# Altium project NAATOS_INLAY_MK8.PrjPcb
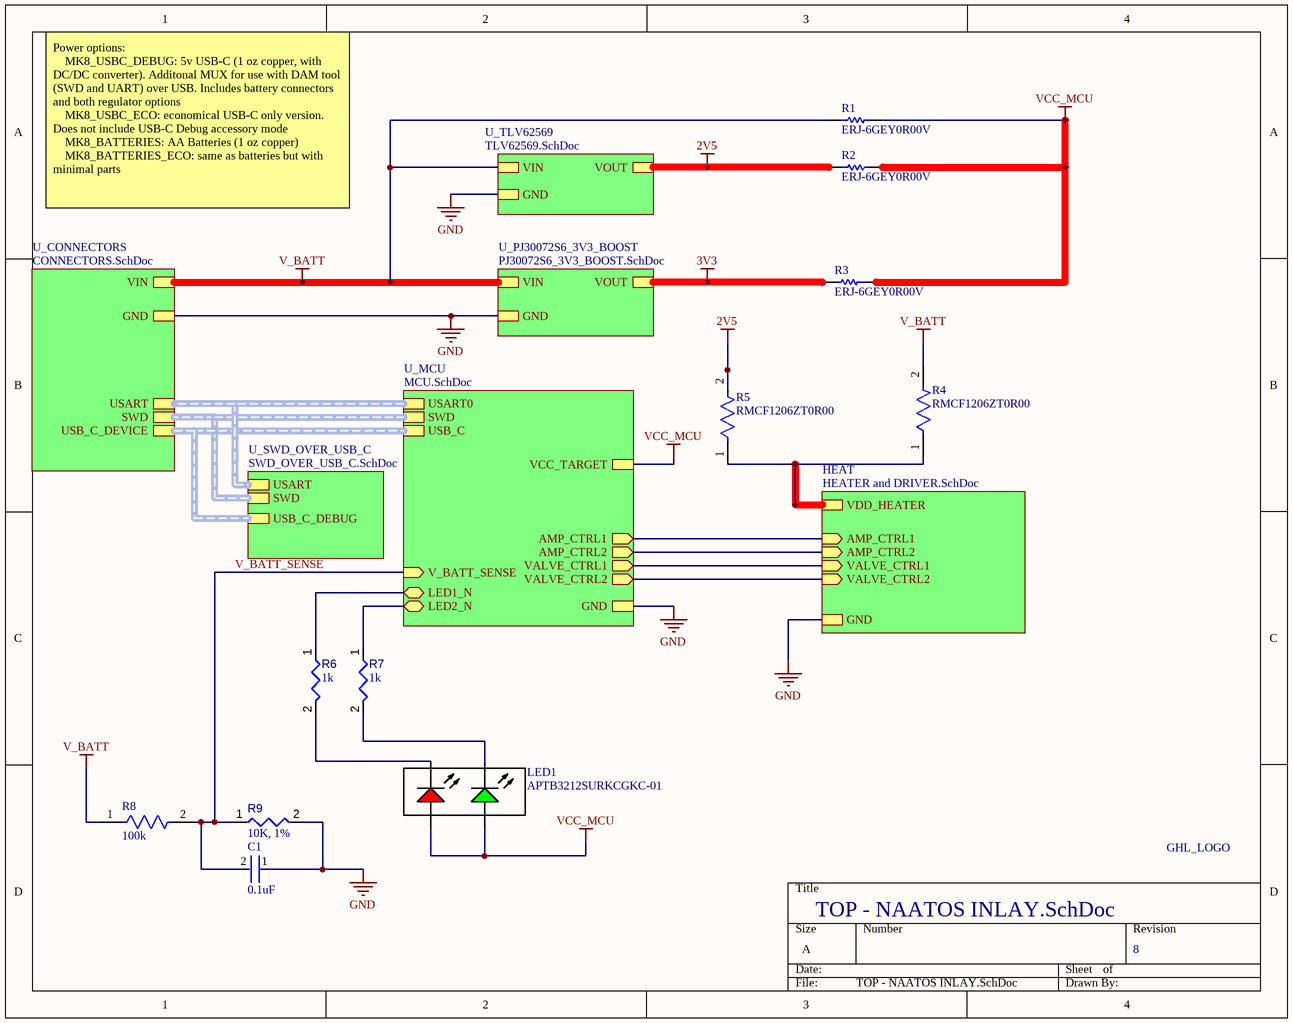
[diagram p0: TOP - NAATOS INLAY.SchDoc]
7 sheets, 78 parts. Net scope: strictly hierarchical (ports join the sheet entries above them; power ports are local).
Board file: INLAY PCB.PcbDoc
Sheets:
  TOP - NAATOS INLAY.SchDoc
    HEAT = HEATER and DRIVER.SchDoc
    U_CONNECTORS = CONNECTORS.SchDoc
    U_MCU = MCU.SchDoc
    U_TLV62569 = TLV62569.SchDoc
    U_PJ30072S6_3V3_BOOST = PJ30072S6_3V3_BOOST.SchDoc
    U_SWD_OVER_USB_C = SWD_OVER_USB_C.SchDoc

## Sheet TOP - NAATOS INLAY.SchDoc
size A; Revision: 8; SheetNumber: 1; SheetTotal: 7

### Parts
C1  0.1uF  [FP-CL17-IPC_C]
LED1  APTB3212SURKCGKC-01  [APTB3212SURKCGKC-01]
LOGO1  GHL_LOGO  [GHLABS_LOGO]
R1  ERJ-6GEY0R00V  [RESC2013X70X40NL20T20]
R2  ERJ-6GEY0R00V  [RESC2013X70X40NL20T20]
R3  ERJ-6GEY0R00V  [RESC2013X70X40NL20T20]
R4  RMCF1206ZT0R00  [FP-RMCF1206-MFG]
R5  RMCF1206ZT0R00  [FP-RMCF1206-MFG]
R6  value 1k  [RESC1608X55X25ML10T15]  (hidden comment: Resistor 1k +/-1% 0603 100 mW)
R7  value 1k  [RESC1608X55X25ML10T15]  (hidden comment: Resistor 1k +/-1% 0603 100 mW)
R8  Resistance: 100k  [FP-CRCW0402-e3-IPC_C]  (hidden comment: CRCW0402100KFKED)
R9  value 10K, 1%  [RESC0402(1005)_L]  (hidden comment: Resistor 10K  +/-1 % 0402 63 mW)

### Sub-sheets
HEAT = HEATER and DRIVER.SchDoc: GND, VDD_HEATER, AMP_CTRL1 (in), VALVE_CTRL1 (in), AMP_CTRL2 (in), VALVE_CTRL2 (in)
U_CONNECTORS = CONNECTORS.SchDoc: GND, USART (harness USART), VIN, USB_C_DEVICE (harness USB_C), SWD (harness SWD)
U_MCU = MCU.SchDoc: USART0 (harness USART), VCC_TARGET, GND, AMP_CTRL1 (out), AMP_CTRL2 (out), VALVE_CTRL1 (out), VALVE_CTRL2 (out), V_BATT_SENSE (in), LED1_N (bidir), LED2_N (bidir), SWD (harness SWD), USB_C (harness USB_C)
U_PJ30072S6_3V3_BOOST = PJ30072S6_3V3_BOOST.SchDoc: VIN, GND, VOUT
U_SWD_OVER_USB_C = SWD_OVER_USB_C.SchDoc: USB_C_DEBUG (harness USB_C), SWD (harness SWD), USART (harness USART)
U_TLV62569 = TLV62569.SchDoc: VOUT, VIN, GND

### Nets
2V5: R2.1 R5.2 ; sheet U_TLV62569/VOUT
3V3: R3.1 ; sheet U_PJ30072S6_3V3_BOOST/VOUT
GND: C1.1 R9.2 ; sheet HEAT/GND, sheet U_CONNECTORS/GND, sheet U_MCU/GND, sheet U_TLV62569/GND, sheet U_PJ30072S6_3V3_BOOST/GND
V_BATT: R1.1 R4.2 R8.1 ; sheet U_CONNECTORS/VIN, sheet U_TLV62569/VIN, sheet U_PJ30072S6_3V3_BOOST/VIN
VCC_MCU: LED1.2(A) LED1.3(A) R1.2 R2.2 R3.2 ; sheet U_MCU/VCC_TARGET
AMP_CTRL1: sheet HEAT/AMP_CTRL1, sheet U_MCU/AMP_CTRL1
AMP_CTRL2: sheet HEAT/AMP_CTRL2, sheet U_MCU/AMP_CTRL2
HEATER+: R4.1 R5.1 ; sheet HEAT/VDD_HEATER
LED1_N: R6.1 ; sheet U_MCU/LED1_N
LED2_N: R7.1 ; sheet U_MCU/LED2_N
V_BATT_SENSE: C1.2 R8.2 R9.1 ; sheet U_MCU/V_BATT_SENSE
VALVE_CTRL1: sheet HEAT/VALVE_CTRL1, sheet U_MCU/VALVE_CTRL1
VALVE_CTRL2: sheet HEAT/VALVE_CTRL2, sheet U_MCU/VALVE_CTRL2
NetLED1_1: LED1.1(K) R6.2
NetLED1_4: LED1.4(K) R7.2

### Buses and harness runs
harness sheet U_CONNECTORS/SWD = sheet U_MCU/SWD = sheet U_SWD_OVER_USB_C/SWD
harness sheet U_CONNECTORS/USART = sheet U_MCU/USART0 = sheet U_SWD_OVER_USB_C/USART
harness sheet U_CONNECTORS/USB_C_DEVICE = sheet U_MCU/USB_C = sheet U_SWD_OVER_USB_C/USB_C_DEBUG

### Notes on the sheet
- Power options:
  MK8_USBC_DEBUG: 5v USB-C (1 oz copper, with DC/DC converter). Additonal MUX for use with DAM tool (SWD and UART) over USB. Includes battery connectors and both regulator options
  MK8_USBC_ECO: economical USB-C only version. Does not include USB-C Debug accessory mode
  MK8_BATTERIES: AA Batteries (1 oz copper)
  MK8_BATTERIES_ECO: same as batteries but with minimal parts

### Library data of the parts
C1 = CMP-13271-001069-1: Cap Ceramic 100nF 10V X7R ±10% SMD 0402 +125°C Paper T/R; Height: 0.5mm; Case/Package: 0402; Contact Plating: Tin; Case Code (Imperial): 0402; Capacitance: 100nF; Thickness: 0.022inch; Min Operating Temperature: -55°C; Package Quantity: 1; Length: 1mm; Max Operating Temperature: 125°C; Depth: 0.5mm; Voltage Rating: 10V; Packaging: Tape and Reel; Mount: Surface Mount; Tolerance: 10%; Width: 0.02inch; Radiation Hardening: No; Case Code (Metric): 1005; Dielectric: X7R
LED1 = APTB3212SURKCGKC-01: Dual Color LED; Manufacturer: Kingbright; Supplier: Mouser; Supplier Part Number: 604-APTB3212SURKCGKC; Manufacturer Part Number: APTB3212SURKCGKC-01; RoHS: Yes; Category: LEDs; Stock: 2181; Pricing: 1=0.59, 10=0.409, 50=0.409, 100=0.295, 500=0.243, 1000=0.226, 2000=0.222, 4000=0.195, 10000=0.18, 24000=0.173 (USD); RoHS Compliant: Yes; ComponentLink1URL: https://datasheet.ciiva.com:443/pdfs/VipMasterIC/IC/KBEC/KBEC-S-A0008946974/KBEC-S-A0008946997-1.pdf?src-supplier=IHS+Markit; ComponentLink1Description: https://datasheet.ciiva.com:443/pdfs/VipMasterIC/IC/KBEC/KBEC-S-A0008946974/KBEC-S-A0008946997-1.pdf?src-supplier=IHS+Markit; Supplier 1: Digikey; Supplier Part Number 1: 754-APTB3212SURKCGKC-01CT-ND
LOGO1 = CMP-439-000000-1: Design Item ID: GHL_LOGO; Source: GHLABS_LOGO.SchLib
R1-R3 = CMP-1665-00002-5: Chip Resistor, 0 Ohm, +/- 1%, 0.125 W, -55 to 155 degC, 0805 (2012 Metric), RoHS, Tape and Reel; Tolerance: 5%; Resistance: 0 Ohm; REACH SVHC: No SVHC; Min Operating Temperature: -55 degC; Case/Package: 0805; Packaging: Tape and Reel; Package Quantity: 5000; ComponentLink1Description: Manufacturer URL; PackageDescription: 2-Pin Surface Mount Device, Body 2 x 1.25 mm; Mounting Technology: Surface Mount; Max Operating Temperature: 155 degC; PartNumber: ERJ-6GEY0R00V; Width: 1.25 mm; RoHSCompliant: True; Height: 0.6 mm; ComponentLink1URL: http://www.panasonic.com/; ComponentLink2URL: http://industrial.panasonic.com/cdbs/www-data/pdf/RDA0000/AOA0000C84.pdf; Case Code (Imperial): 0805; DatasheetVersion: 03/2015; Length: 2 mm; Case Code (Metric): 2012; ComponentLink2Description: Datasheet; Radiation Hardening: No
R4 R5 = CMP-26527-005649-1: 0Ω ±0 0.25W 1206 Thick Film Chip Resistor AEC-Q200 compliant; Working Voltage: 200V; Power Rating: 250mW; Current Rating: 2A; Resistance: 0R; Construction: Rectangular; RoHS Compliant: Yes; Military Standard: Not; Radiation Hardening: No; Case/Package: 1206; Case Code (Imperial): 1206; Packaging: Tape and Reel; Resistor Type: Thick Film; Mount: Surface Mount; Lead Free: Lead Free; Case Code (Metric): 3216; Width: 0.063inch; Series: RMCF; Features: Automotive AEC-Q200; Number of Terminations: 2; Min Operating Temperature: -55°C; Max Power Dissipation: 250mW; Contact Plating: Tin; Length: 0.126inch; Height: 0.028inch; Technology: THICK FILM; Max Operating Temperature: 155°C; Depth: 1.6mm
R6 R7 = CMP-009-00014-4: Chip Resistor, 1 KOhm, +/-1%, 0.1 W, -55 to 155 degC, 0603 (1608 Metric); Power: 100mW; Tolerance: 1%; Voltage Rating: 50V; Max Operating Temperature: 155°C; Pins: 2; RoHS Compliant: True; Case/Package: 0603; Min Operating Temperature: -55°C; Mounting Technology: SM
R8 = CMP-2002-08123-3: RES Thick Film, 100kΩ, 1%, 0.063W, 100ppm/°C, 0402; Power Rating: 63mW; Voltage Rating (DC): 50V; Lead Free: Lead Free; Height: 0.35mm; Contact Plating: Tin; Min Operating Temperature: -55°C; Package Quantity: 10000; Case/Package: 0402; Temperature Coefficient: 100ppm/°C; Number of Terminations: 2; Packaging: Tape and Reel; Max Power Dissipation: 63mW; Case Code (Metric): 1005; Mount: Surface Mount; Width: 0.02inch; Termination: SMD/SMT; Length: 1mm; Number of Pins: 2; Weight: 2.3E-05oz; Radiation Hardening: No; Tolerance: 1%; Military Standard: Not; Features: Automotive AEC-Q200; Depth: 0.5mm; Composition: Thick Film; Max Operating Temperature: 155°C; Voltage Rating: 50V; Case Code (Imperial): 0402
R9 = CMP-009-00149-2: Chip Resistor, 10 kOhms, +/-1 %, 63 mW, -55 to 125 degC, 0402; Power: 63mW; Tolerance: 1%; Pins: 2; Max Operating Temperature: 155°C; Min Operating Temperature: -55°C; Case/Package: 0402

## Sheet HEATER and DRIVER.SchDoc
size A3; SheetNumber: 2; SheetTotal: 7
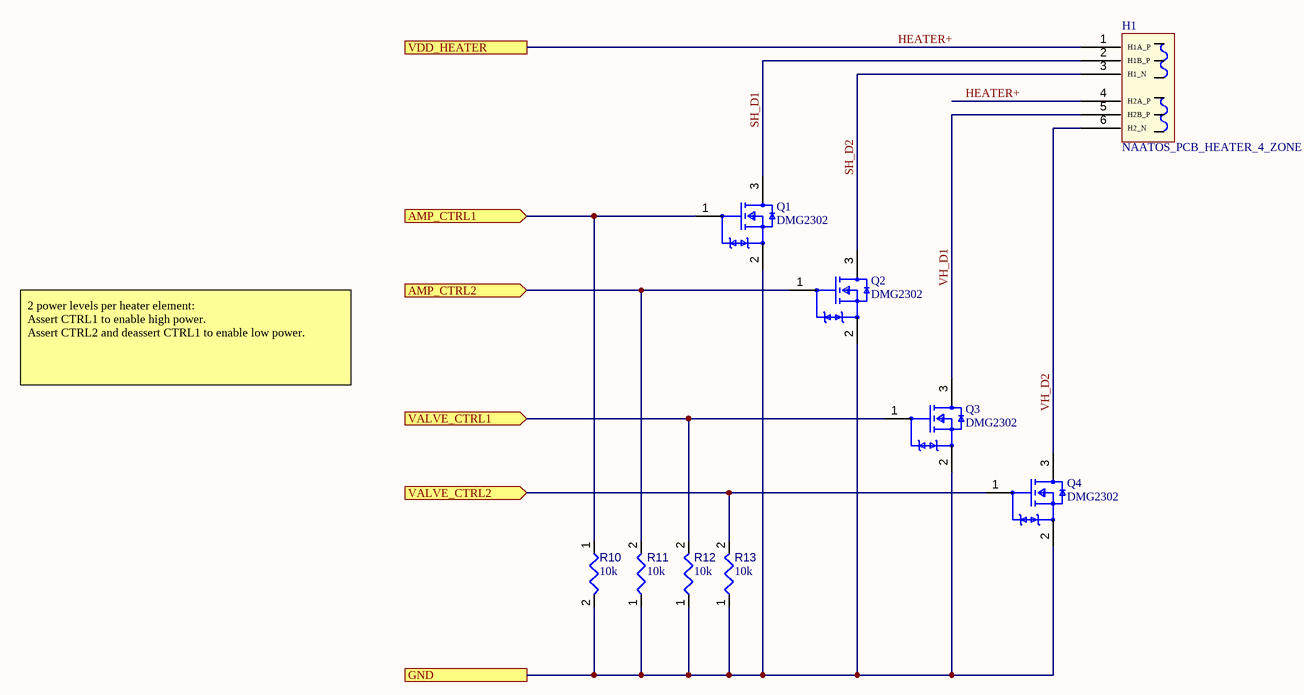
[diagram p1: HEATER and DRIVER.SchDoc]

### Parts
H1  NAATOS_PCB_HEATER_4_ZONE  [REV9-1]  (net tie, no BOM)
Q1  DMG2302  [FP-SOT23-MFG]
Q2  DMG2302  [FP-SOT23-MFG]
Q3  DMG2302  [FP-SOT23-MFG]
Q4  DMG2302  [FP-SOT23-MFG]
R10  value 10k  [RESC0402(1005)_L]  (hidden comment: Resistor 10K  +/-1 % 0402 63 mW)
R11  value 10k  [RESC0402(1005)_L]  (hidden comment: Resistor 10K  +/-1 % 0402 63 mW)
R12  value 10k  [RESC0402(1005)_L]  (hidden comment: Resistor 10K  +/-1 % 0402 63 mW)
R13  value 10k  [RESC0402(1005)_L]  (hidden comment: Resistor 10K  +/-1 % 0402 63 mW)

### Ports
AMP_CTRL1 (in), AMP_CTRL2 (in), GND, VALVE_CTRL1 (in), VALVE_CTRL2 (in), VDD_HEATER

### Nets
GND: Q1.2(S) Q2.2(S) Q3.2(S) Q4.2(S) R10.2 R11.1 R12.1 R13.1 ; port GND
AMP_CTRL1: Q1.1(G) R10.1 ; port AMP_CTRL1
AMP_CTRL2: Q2.1(G) R11.2 ; port AMP_CTRL2
HEATER+: H1.1(H1A_P) H1.4(H2A_P) ; port VDD_HEATER
SH_D1: H1.2(H1B_P) Q1.3(D)
SH_D2: H1.3(H1_N) Q2.3(D)
VALVE_CTRL1: Q3.1(G) R12.2 ; port VALVE_CTRL1
VALVE_CTRL2: Q4.1(G) R13.2 ; port VALVE_CTRL2
VH_D1: H1.5(H2B_P) Q3.3(D)
VH_D2: H1.6(H2_N) Q4.3(D)

### Notes on the sheet
- 2 power levels per heater element:
  Assert CTRL1 to enable high power.
  Assert CTRL2 and deassert CTRL1 to enable low power.
- Sheet Title
- PCB Project Name
- Modified
- Sheet
- of

### Library data of the parts
H1 = CMP-448-000000-8: Source: NAATOS_PCB_HEATER_4ELEMENT.SchLib; Design Item ID: NAATOS_PCB_HEATERS
Q1-Q4 = CMP-013-00036-2: Small Signal Field-Effect Transistor, 2.8A I(D), 20V, 1-Element, N-Channel, Silicon, Metal-oxide Semiconductor FET; Manufacturing Lifecycle 1: Unknown; Manufacturer 1: HXY Mosfet; Manufacturer Part Number 1: DMG2302U-HXY; Vgs (Max): 12V; Supplier Unit Price 1: .009; Supplier Part Number 1: C22367244; Min Operating Temperature: -55°C; Max Operating Temperature: 150°C; Case/Package: SOT-23; RoHS Compliant: Yes; Supplier 1: LCSC; Pins: 3; ComponentLink1URL: https://www.lcsc.com/product-detail/MOSFETs_HXY-MOSFET-DMG2302U-HXY_C22367244.html?s_z=n_DMG2302
R10-R13 = CMP-009-00149-2: as R9 on sheet TOP - NAATOS INLAY; Pins: 2; Max Operating Temperature: 155°C; Min Operating Temperature: -55°C; Case/Package: 0402

## Sheet CONNECTORS.SchDoc
size A3; SheetNumber: 4; SheetTotal: 7
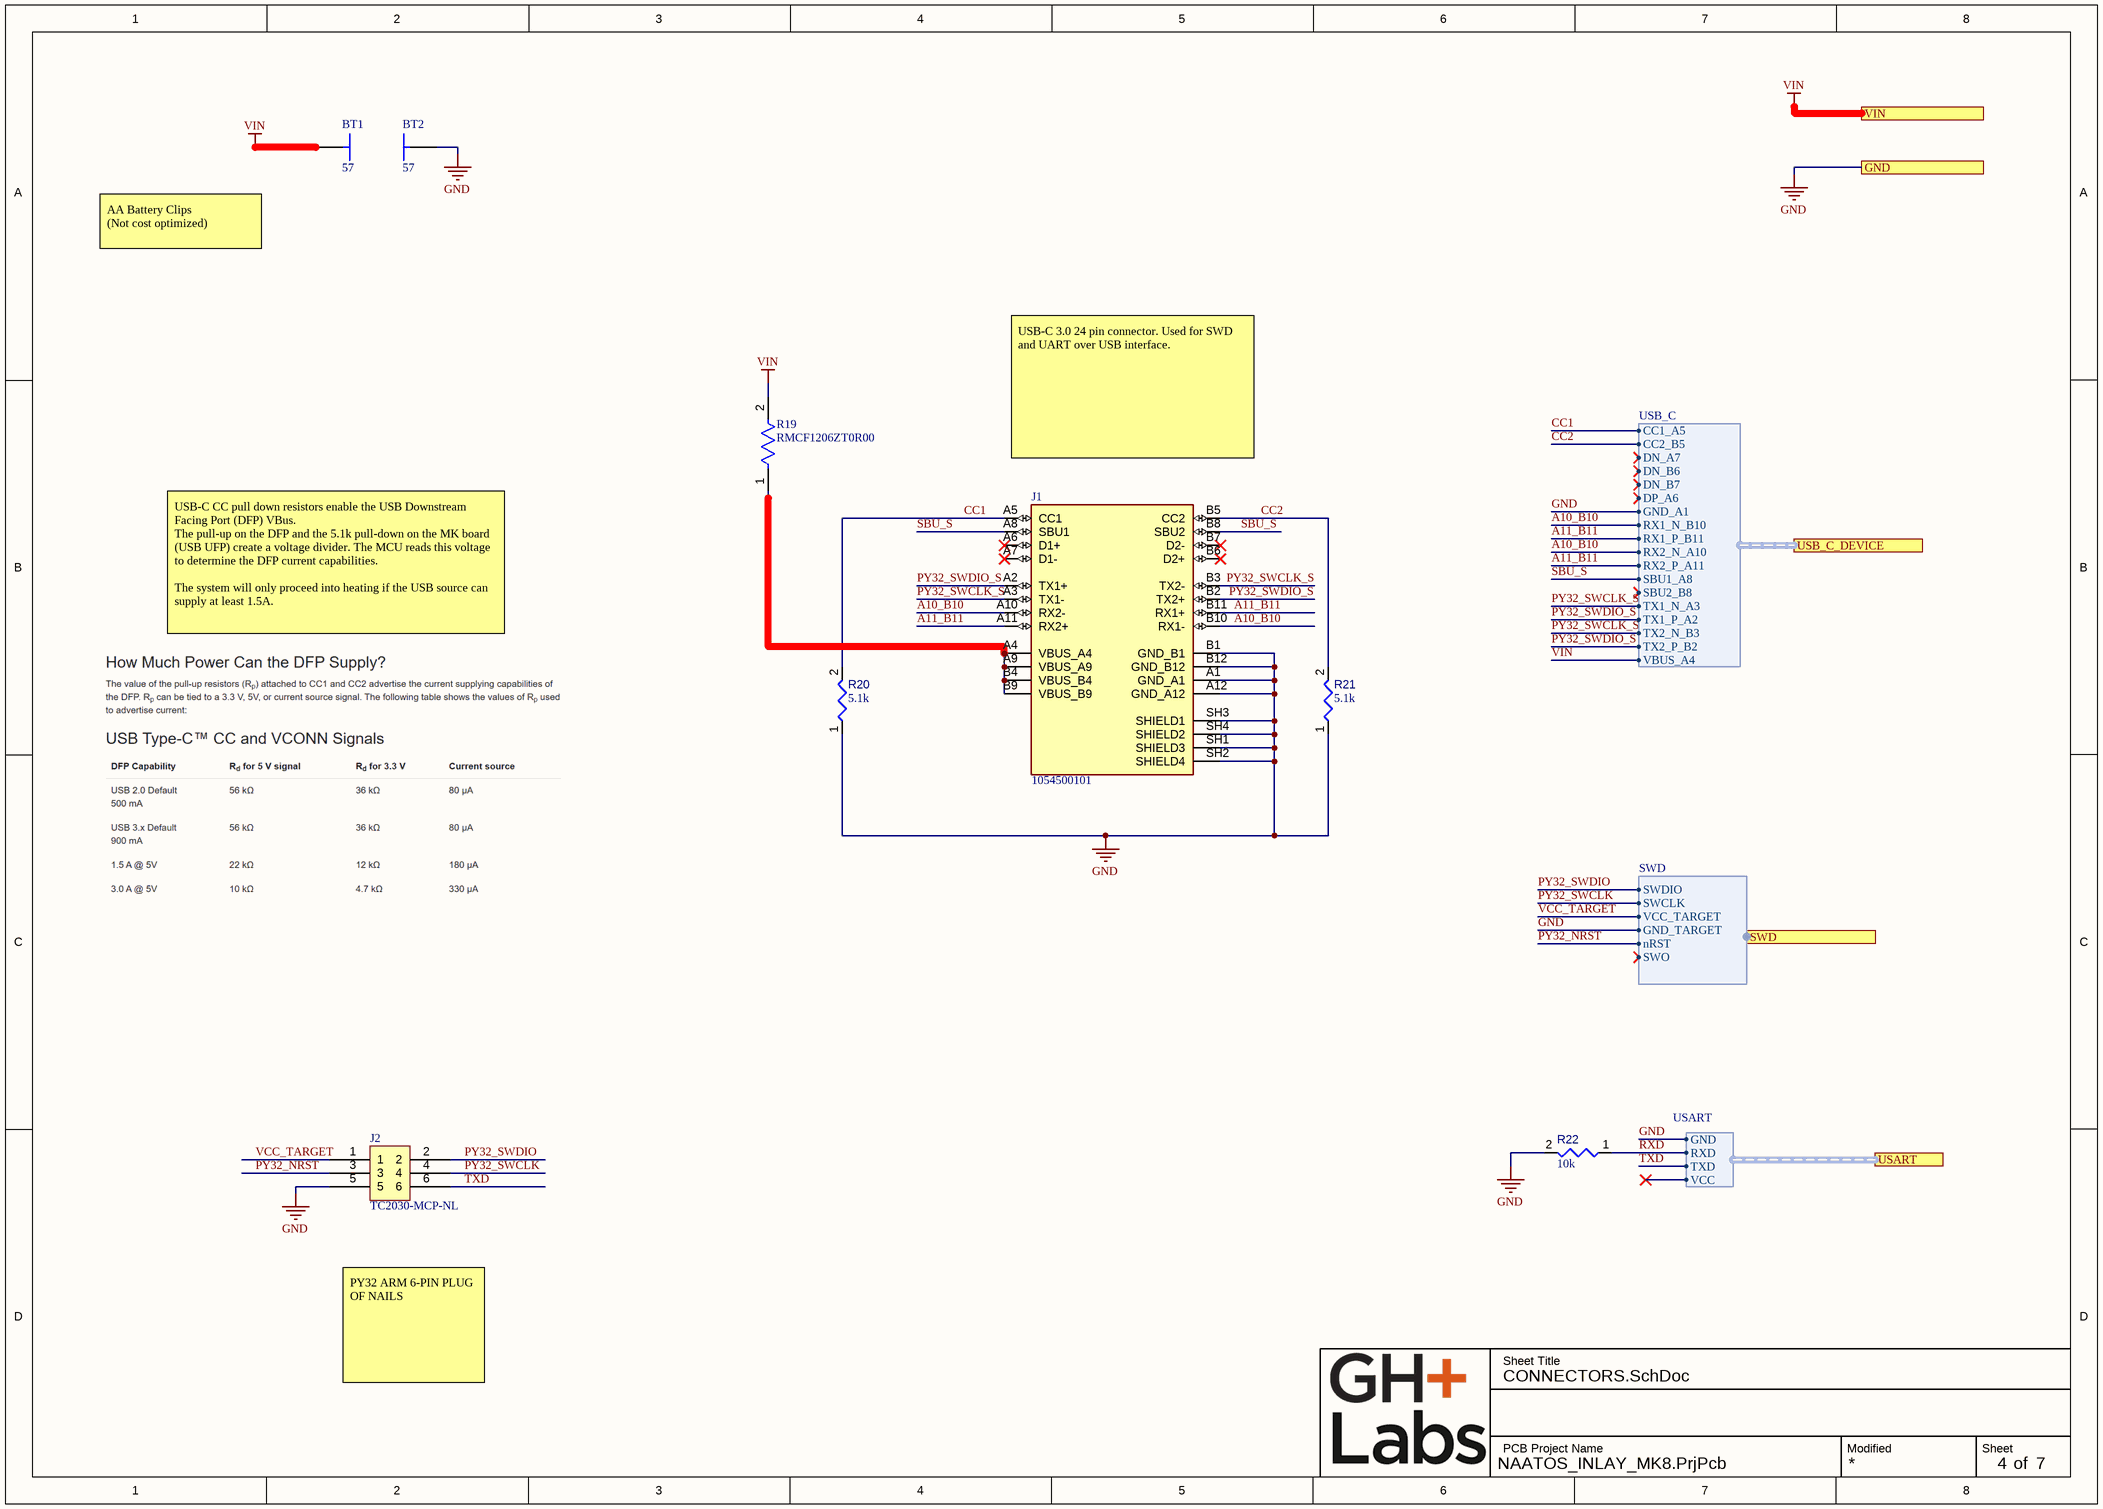
[diagram p2: CONNECTORS.SchDoc]

### Parts
BT1  57  [57-Footprint-1]
BT2  57  [57-Footprint-1]
J1  1054500101  [MOLEX_1054500101]
J2  TC2030-MCP-NL  [TC2030-MCP-NL]
R19  RMCF1206ZT0R00  [FP-RMCF1206-MFG]
R20  value 5.1k  [RESC0402(1005)_L]  (hidden comment: Resistor 5K1 +/-1 % 0402 63 mW)
R21  value 5.1k  [RESC0402(1005)_L]  (hidden comment: Resistor 5K1 +/-1 % 0402 63 mW)
R22  value 10k  [RESC0402(1005)_L]  (hidden comment: Resistor 10K  +/-1 % 0402 63 mW)

### Ports
GND, SWD (harness SWD), USART (harness USART), USB_C_DEVICE (harness USB_C), VIN

### Harnesses
USART: GND, RXD, TXD, VCC
USB_C: CC1_A5, CC2_B5, DN_A7, DN_B6, DN_B7, DP_A6, GND_A1, RX1_N_B10, RX1_P_B11, RX2_N_A10, RX2_P_A11, SBU1_A8, SBU2_B8, TX1_N_A3, TX1_P_A2, TX2_N_B3, TX2_P_B2, VBUS_A4
SWD: SWDIO, SWCLK, VCC_TARGET, GND_TARGET, nRST, SWO

### Nets
GND: BT2.P_1(POS) J1.A1(GND_A1) J1.A12(GND_A12) J1.B1(GND_B1) J1.B12(GND_B12) J1.SH1(SHIELD3) J1.SH2(SHIELD4) J1.SH3(SHIELD1) J1.SH4(SHIELD2) J2.5 R20.1 R21.1 R22.2 ; port GND, port USART.GND, port USB_C_DEVICE.GND_A1, port SWD.GND_TARGET
VCC_TARGET: J2.1 ; port USART.VCC, port SWD.VCC_TARGET  [project net VCC_MCU]
VIN: BT1.P_1(POS) R19.2 ; port VIN, port USB_C_DEVICE.VBUS_A4  [project net V_BATT]
A10_B10: J1.A10(RX2-) J1.B10(RX1-) ; port USB_C_DEVICE.RX1_N_B10, port USB_C_DEVICE.RX2_N_A10
A11_B11: J1.A11(RX2+) J1.B11(RX1+) ; port USB_C_DEVICE.RX1_P_B11, port USB_C_DEVICE.RX2_P_A11
CC1: J1.A5(CC1) R20.2 ; port USB_C_DEVICE.CC1_A5
CC2: J1.B5(CC2) R21.2 ; port USB_C_DEVICE.CC2_B5
PY32_NRST: J2.3 ; port SWD.nRST
PY32_SWCLK: J2.4 ; port SWD.SWCLK
PY32_SWCLK_S: J1.A3(TX1-) J1.B3(TX2-) ; port USB_C_DEVICE.TX1_N_A3, port USB_C_DEVICE.TX2_N_B3
PY32_SWDIO: J2.2 ; port SWD.SWDIO
PY32_SWDIO_S: J1.A2(TX1+) J1.B2(TX2+) ; port USB_C_DEVICE.TX1_P_A2, port USB_C_DEVICE.TX2_P_B2
RXD: R22.1 ; port USART.RXD
SBU_S: J1.A8(SBU1) J1.B8(SBU2) ; port USB_C_DEVICE.SBU1_A8, port USB_C_DEVICE.SBU2_B8
TXD: J2.6 ; port USART.TXD
NetJ1_A4: J1.A4(VBUS_A4) J1.A9(VBUS_A9) J1.B4(VBUS_B4) J1.B9(VBUS_B9) R19.1

Not connected (* = marked no-connect by the designer): J1 A6(D1+)* A7(D1-)* B6(D2+)* B7(D2-)*

### Notes on the sheet
- AA Battery Clips
  (Not cost optimized)
- USB-C 3.0 24 pin connector. Used for SWD and UART over USB interface.
- USB-C CC pull down resistors enable the USB Downstream Facing Port (DFP) VBus.
  The pull-up on the DFP and the 5.1k pull-down on the MK board (USB UFP) create a voltage divider. The MCU reads this voltage to determine the DFP current capabilities.
  The system will only proceed into heating if the USB source can supply at least 1.5A.
- PY32 ARM 6-PIN PLUG OF NAILS
- Sheet Title
- PCB Project Name
- Modified
- Sheet
- of

### Library data of the parts
BT1 BT2 = CMP-002-00078-5: A /AA SMT BATTERY CONTACT; MF: Keystone Electronics; Value: *; Design Item ID: 57; Case/Package: None; Component Type: Standard; MP: 57; Pins: 2; Check_prices: https://www.snapeda.com/parts/57/Keystone/view-part/?ref=eda; Source: 57.SchLib; SnapEDA_Link: https://www.snapeda.com/parts/57/Keystone/view-part/?ref=snap
J1 = CMP-002-00075-3: USB-C (USB TYPE-C) USB 3.2 Gen 2 (USB 3.1 Gen 2, Superspeed + (USB 3.1)) Receptacle Connector 24 Position Surface Mount, Right Angle; Through Hole; MF: Molex; Component Type: Standard; SnapEDA_Link: https://www.snapeda.com/parts/1054500101/Molex/view-part/?ref=snap; Pins: 28; Check_prices: https://www.snapeda.com/parts/1054500101/Molex/view-part/?ref=eda; Design Item ID: 1054500101; MP: 1054500101; Source: 1054500101.SchLib; Case/Package: None; Value: *
J2 = TC2030-MCP-NL: TAG CONNECT FOR UPDI
R19 = CMP-26527-005649-1: as R4 on sheet TOP - NAATOS INLAY; Construction: Rectangular; RoHS Compliant: Yes; Military Standard: Not; Radiation Hardening: No; Case/Package: 1206; Case Code (Imperial): 1206; Packaging: Tape and Reel; Resistor Type: Thick Film; Mount: Surface Mount; Lead Free: Lead Free; Case Code (Metric): 3216; Width: 0.063inch; Series: RMCF; Features: Automotive AEC-Q200; Number of Terminations: 2; Min Operating Temperature: -55°C; Max Power Dissipation: 250mW; Contact Plating: Tin; Length: 0.126inch; Height: 0.028inch; Technology: THICK FILM; Max Operating Temperature: 155°C; Depth: 1.6mm
R20 R21 = CMP-009-00177-1: Chip Resistor, 5.1 kOhms, +/-1 %, 63 mW, -55 to 155 degC, 0402; Power: 63mW; Tolerance: 1%; Case/Package: 0402; Pins: 2; RoHS Compliant: Yes; Max Operating Temperature: 155°C; Min Operating Temperature: -55°C; Mounting Technology: Surface Mount
R22 = CMP-009-00149-2: as R9 on sheet TOP - NAATOS INLAY; Pins: 2; Max Operating Temperature: 155°C; Min Operating Temperature: -55°C; Case/Package: 0402

## Sheet MCU.SchDoc
size A3; SheetNumber: 3; SheetTotal: 7
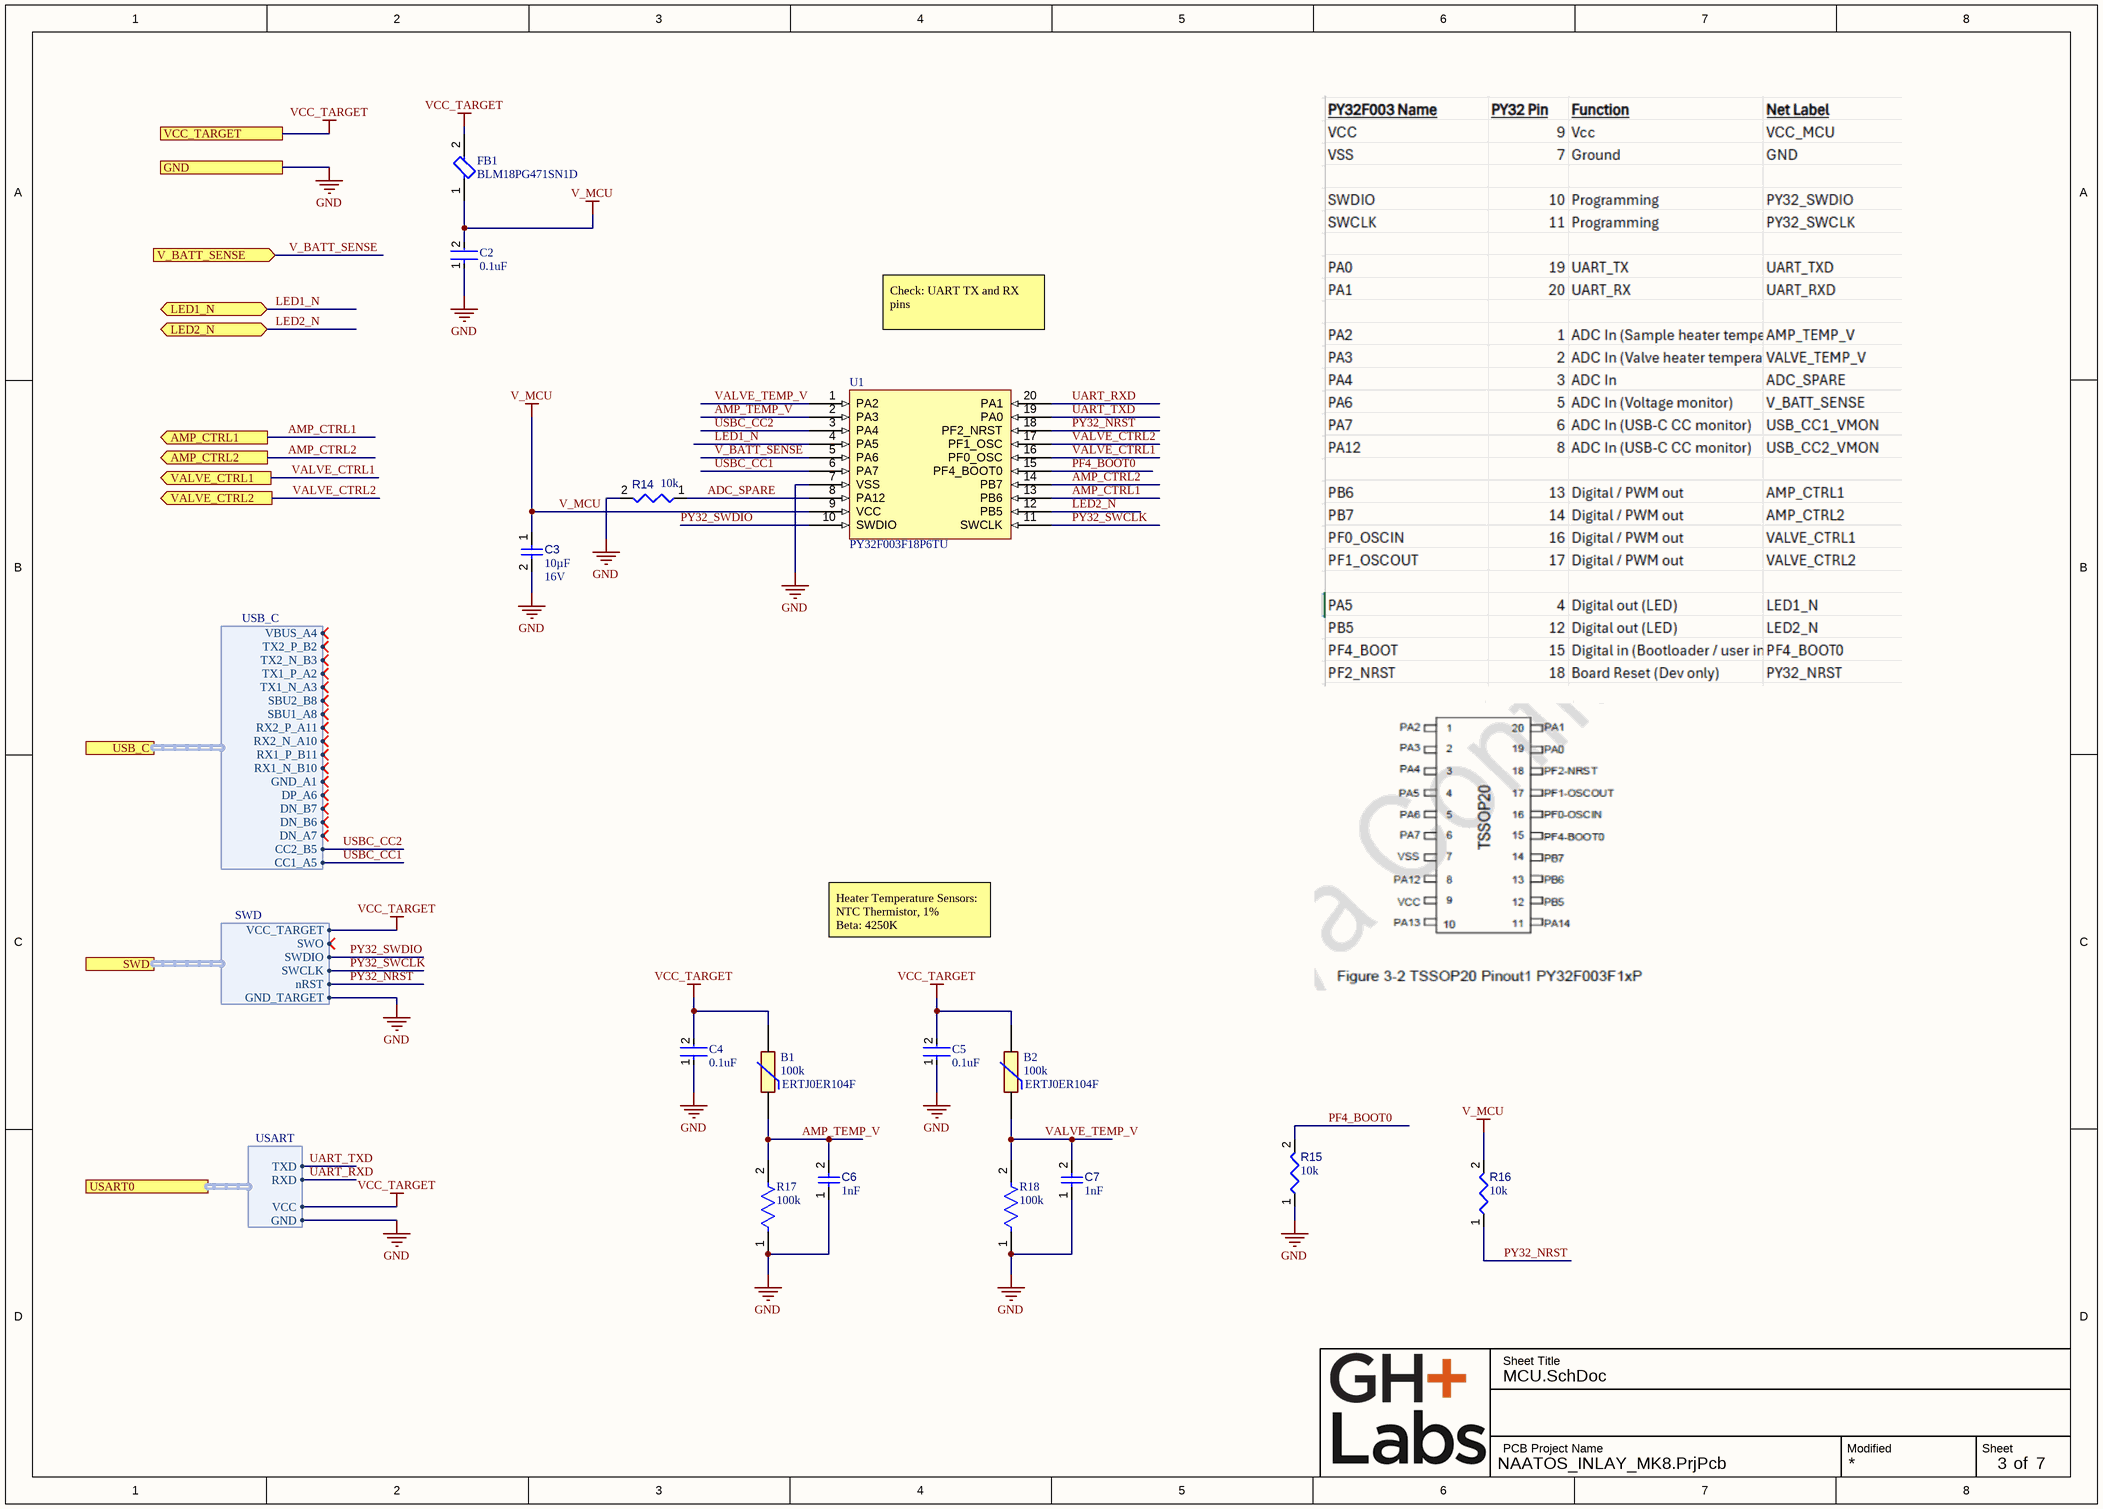
[diagram p3: MCU.SchDoc]

### Parts
B1  value 100k  [THRMC1005X55N]  (hidden comment: ERTJ0ER104F)
B2  value 100k  [THRMC1005X55N]  (hidden comment: ERTJ0ER104F)
C2  0.1uF  [FP-CL17-IPC_C]
C3  value 10µF  Voltage Rating: 16V  [CAPC1608X09N]  (hidden comment: CL10A106MO8NQNC)
C4  0.1uF  [FP-CL17-IPC_C]
C5  0.1uF  [FP-CL17-IPC_C]
C6  value 1nF  [FP-C0402C102K4RAC7411-IPC_B]  (hidden comment: C0402C102K4RAC7411)
C7  value 1nF  [FP-C0402C102K4RAC7411-IPC_B]  (hidden comment: C0402C102K4RAC7411)
FB1  BLM18PG471SN1D  [FP-BLM18-0_15-t0_8-MFG]
R14  value 10k  [RESC0402(1005)_L]  (hidden comment: Resistor 10K  +/-1 % 0402 63 mW)
R15  value 10k  [RESC0402(1005)_L]  (hidden comment: Resistor 10K  +/-1 % 0402 63 mW)
R16  value 10k  [RESC0402(1005)_L]  (hidden comment: Resistor 10K  +/-1 % 0402 63 mW)
R17  Resistance: 100k  [FP-CRCW0402-e3-IPC_C]  (hidden comment: CRCW0402100KFKED)
R18  Resistance: 100k  [FP-CRCW0402-e3-IPC_C]  (hidden comment: CRCW0402100KFKED)
U1  PY32F003F18P6TU  [SOP65P640X120-20N]

### Ports
AMP_CTRL1 (out), AMP_CTRL2 (out), GND, LED1_N (bidir), LED2_N (bidir), SWD (harness SWD), USART0 (harness USART), USB_C (harness USB_C), V_BATT_SENSE (in), VALVE_CTRL1 (out), VALVE_CTRL2 (out), VCC_TARGET

### Harnesses
USART: RXD, VCC, GND, TXD
SWD: GND_TARGET, nRST, SWCLK, SWDIO, SWO, VCC_TARGET
USB_C: CC1_A5, CC2_B5, DN_A7, DN_B6, DN_B7, DP_A6, GND_A1, RX1_N_B10, RX1_P_B11, RX2_N_A10, RX2_P_A11, SBU1_A8, SBU2_B8, TX1_N_A3, TX1_P_A2, TX2_N_B3, TX2_P_B2, VBUS_A4

### Nets
GND: C2.1 C3.2 C4.1 C5.1 C6.1 C7.1 R14.2 R15.1 R17.1 R18.1 U1.7(VSS) ; port GND, port USART0.GND, port SWD.GND_TARGET, port USB_C.GND_A1
V_MCU: C2.2 C3.1 FB1.1 R16.2 U1.9(VCC)
VCC_TARGET: B1.2 B2.2 C4.2 C5.2 FB1.2 ; port VCC_TARGET, port USART0.VCC, port SWD.VCC_TARGET  [project net VCC_MCU]
A10_B10: port USB_C.RX1_N_B10, port USB_C.RX2_N_A10
A11_B11: port USB_C.RX1_P_B11, port USB_C.RX2_P_A11
ADC_SPARE: R14.1 U1.8(PA12)
AMP_CTRL1: U1.13(PB6) ; port AMP_CTRL1
AMP_CTRL2: U1.14(PB7) ; port AMP_CTRL2
AMP_TEMP_V: B1.1 C6.2 R17.2 U1.2(PA3)
LED1_N: U1.4(PA5) ; port LED1_N
LED2_N: U1.12(PB5) ; port LED2_N
PF4_BOOT0: R15.2 U1.15(PF4_BOOT0)
PY32_NRST: R16.1 U1.18(PF2_NRST) ; port SWD.nRST
PY32_SWCLK: U1.11(SWCLK) ; port SWD.SWCLK
PY32_SWCLK_S: port USB_C.TX1_N_A3, port USB_C.TX2_N_B3
PY32_SWDIO: U1.10(SWDIO) ; port SWD.SWDIO
PY32_SWDIO_S: port USB_C.TX1_P_A2, port USB_C.TX2_P_B2
SBU_S: port USB_C.SBU1_A8, port USB_C.SBU2_B8
UART_RXD: U1.20(PA1) ; port USART0.RXD  [project net RXD]
UART_TXD: U1.19(PA0) ; port USART0.TXD  [project net TXD]
USBC_CC1: U1.6(PA7) ; port USB_C.CC1_A5  [project net CC1]
USBC_CC2: U1.3(PA4) ; port USB_C.CC2_B5  [project net CC2]
V_BATT_SENSE: U1.5(PA6) ; port V_BATT_SENSE
VALVE_CTRL1: U1.16(PF0_OSC) ; port VALVE_CTRL1
VALVE_CTRL2: U1.17(PF1_OSC) ; port VALVE_CTRL2
VALVE_TEMP_V: B2.1 C7.2 R18.2 U1.1(PA2)

### Notes on the sheet
- Check: UART TX and RX pins
- Heater Temperature Sensors:
  NTC Thermistor, 1%
  Beta: 4250K
- Sheet Title
- PCB Project Name
- Modified
- Sheet
- of

### Library data of the parts
B1 B2 = CMP-009-00178-1: Thermistor, NTC, 100k, 1%,  4250k, 0402; Manufacturer 1: Panasonic; Manufacturer Lifecycle 1: Unknown; Power: 66mW; Geometry.Height: 0.55mm; Min Operating Temperature: -40°C; Design Item ID: ERTJ0ER104F; Supplier Part Number 1: C236279; Mouser Part Number: 667-ERT-J0ER104FM; Datasheet Link: https://industrial.panasonic.com/cdbs/www-data/pdf/AUA0000/AUA0000C8.pdf; Max Operating Temperature: 125°C; Manufacturer_Name: Panasonic; Tolerance: 1%; Supplier Unit Price 1: .0262; Manufacturer Part Number 1: ERTJ0ER104F; Supplier 1: LCSC; Manufacturer_Part_Number: ERTJ0ER104F; RoHS Compliant: Yes; Pins: 2; Mounting Technology: Surface Mount; Mouser Price/Stock: https://www.mouser.com/ProductDetail/Panasonic/ERT-J0ER104FM
C2 C4 C5 = CMP-13271-001069-1: as C1 on sheet TOP - NAATOS INLAY; Height: 0.5mm; Case/Package: 0402; Contact Plating: Tin; Case Code (Imperial): 0402; Capacitance: 100nF; Thickness: 0.022inch; Min Operating Temperature: -55°C; Package Quantity: 1; Length: 1mm; Max Operating Temperature: 125°C; Depth: 0.5mm; Voltage Rating: 10V; Packaging: Tape and Reel; Mount: Surface Mount; Tolerance: 10%; Width: 0.02inch; Radiation Hardening: No; Case Code (Metric): 1005; Dielectric: X7R
C3 = CMP-001-00088-2: Ceramic Capacitor, Multilayer, Ceramic, 16V, 20% +Tol, 20% -Tol, X5R, 15% TC, 10uF, Surface Mount, 0603; Manufacturer 1: Samsung; Manufacturer Lifecycle 1: Unknown; RoHS Compliant: Yes; Min Operating Temperature: -55°C; Manufacturer Part Number 1: CL10A106MO8NQNC; Case/Package: 0603; Supplier 1: LCSC; Supplier Unit Price 1: .007; Capacitor Type: Ceramic; Supplier Part Number 1: C92487; Max Operating Temperature: 85°C; Pins: 2; Mounting Technology: Surface Mount
C6 C7 = CMP-001-00087-1: Ceramic Capacitor, Multilayer, Ceramic, 16V, 10% +Tol, 10% -Tol, X7R, 15% TC, 0.001uF, Surface Mount, 0402; Min Operating Temperature: -55°C; RoHS Compliant: Yes; Max Operating Temperature: 125°C; Case/Package: 0402; Pins: 2; Capacitor Type: Ceramic
FB1 = CMP-0686-00587-3: Chip Ferrite Bead, 0603, 470Ω @ 100MHz, 0.2Ω, 25%, 1A; DC Resistance (DCR): 200mR; Number of Circuits: 1; Material: Steel; Impedance: 470R; Core Material: Ferrite; Width: 0.8mm; Termination: SMD/SMT; Series: BLM18P; Min Operating Temperature: -55°C; DC Resistance-Max: 200mR; Current Rating: 1A; Package Quantity: 1; Max Operating Temperature: 125°C; Military Standard: Not; REACH SVHC: No SVHC; Max Current Rating: 1A; Number of Pins: 2; RoHS Compliant: Yes; Tolerance: 25%; Packaging: Tape and Reel; Number of Lines: 1; Resistance: 200mR; Length: 1.6mm; Case Code (Metric): 1608; Depth: 0.8mm; Lead Free: Lead Free; Case/Package: 0603; Height: 0.8mm; Radiation Hardening: No; Test Frequency: 100MHz; Case Code (Imperial): 0603; Max DC Current: 1A; DC Current: 1A
R14-R16 = CMP-009-00149-2: as R9 on sheet TOP - NAATOS INLAY; Pins: 2; Max Operating Temperature: 155°C; Min Operating Temperature: -55°C; Case/Package: 0402
R17 R18 = CMP-2002-08123-3: as R8 on sheet TOP - NAATOS INLAY; Lead Free: Lead Free; Height: 0.35mm; Contact Plating: Tin; Min Operating Temperature: -55°C; Package Quantity: 10000; Case/Package: 0402; Temperature Coefficient: 100ppm/°C; Number of Terminations: 2; Packaging: Tape and Reel; Max Power Dissipation: 63mW; Case Code (Metric): 1005; Mount: Surface Mount; Width: 0.02inch; Termination: SMD/SMT; Length: 1mm; Number of Pins: 2; Weight: 2.3E-05oz; Radiation Hardening: No; Tolerance: 1%; Military Standard: Not; Features: Automotive AEC-Q200; Depth: 0.5mm; Composition: Thick Film; Max Operating Temperature: 155°C; Voltage Rating: 50V; Case Code (Imperial): 0402
U1 = CMP-020-00023-5: IC, MCU, ARM Cortex M0+, TSSOP-20, PY32F003F18P6TU; Manufacturer Lifecycle 1: Unknown; Manufacturer 1: Puya Semiconductor; Max Supply Voltage: 5.5V; Min Supply Voltage: 1.7V; Case/Package: TSSOP-20; Min Operating Temperature: -40°C; Pins: 20; ComponentLink2Description: https://github.com/decaday/PY32_Docs/tree/main/PY32F030_003_002A/Datasheet/PY32F003; Max Operating Temperature: 85°C; Supplier 1: LCSC; Supplier Unit Price 1: .155; Supplier Part Number 1: C5379864; Manufacturer Part Number 1: PY32F003F18P6TU

## Sheet TLV62569.SchDoc
size A3; SheetNumber: 6; SheetTotal: 7
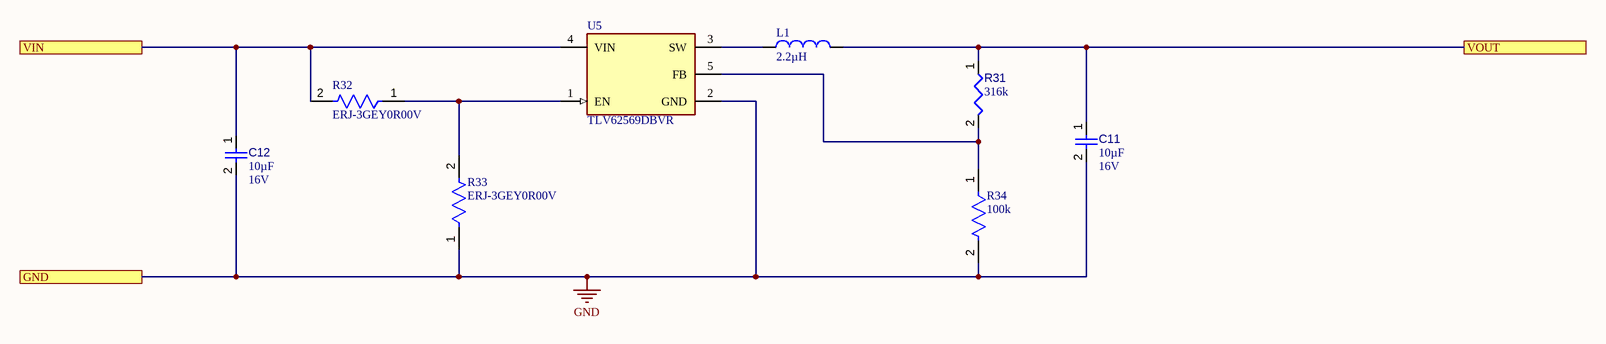
[diagram p4: TLV62569.SchDoc]

### Parts
C11  value 10µF  Voltage Rating: 16V  [CAPC1608X09N]  (hidden comment: CL10A106MO8NQNC)
C12  value 10µF  Voltage Rating: 16V  [CAPC1608X09N]  (hidden comment: CL10A106MO8NQNC)
L1  value 2.2µH  [INDC5050X40N]  (hidden comment: CMLW5040S2R2MST)
R31  value 316k  [RESC0402(1005)_L]  (hidden comment: Resistor 316K +/-1 % 0402 63 mW)
R32  ERJ-3GEY0R00V  [FP-ERJ-3GEY0R00V-MFG]
R33  ERJ-3GEY0R00V  [FP-ERJ-3GEY0R00V-MFG]
R34  Resistance: 100k  [FP-CRCW0402-e3-IPC_C]  (hidden comment: CRCW0402100KFKED)
U5  TLV62569DBVR  [FP-DBV0005A-IPC_B]

### Ports
GND, VIN, VOUT

### Nets
2V5: C11.1 L1.2 R31.1 ; port VOUT
GND: C11.2 C12.2 R33.1 R34.2 U5.2(GND) ; port GND
V_BATT: C12.1 R32.2 U5.4(VIN) ; port VIN
NetL1_1: L1.1 U5.3(SW)
NetR31_2: R31.2 R34.1 U5.5(FB)
NetR32_1: R32.1 R33.2 U5.1(EN)

### Notes on the sheet
- Sheet Title
- PCB Project Name
- Modified
- Sheet
- of

### Library data of the parts
C11 C12 = CMP-001-00088-2: as C3 on sheet MCU; RoHS Compliant: Yes; Min Operating Temperature: -55°C; Manufacturer Part Number 1: CL10A106MO8NQNC; Case/Package: 0603; Supplier 1: LCSC; Supplier Unit Price 1: .007; Capacitor Type: Ceramic; Supplier Part Number 1: C92487; Max Operating Temperature: 85°C; Pins: 2; Mounting Technology: Surface Mount
L1 = CMP-006-00022-1: Shielded wirewound inductor, 2.2uH, 20%, 3.95A, 17 mohm DCR; Manufacturer 1: Cybermax; Manufacturer Lifecycle 1: Unknown; Supplier Part Number 1: CMLW5040S2R2MST; Case/Package: SMD; Supplier Unit Price 1: .034; Min Operating Temperature: 125°C; Pins: 2; Supplier 1: LCSC; Tolerance: 20%; Manufacturer Part Number 1: CMLW5040S2R2MST; Max Operating Temperature: -40°C
R31 = CMP-009-00142-2: Chip Resistor, 316 kOhms, +/-1 %, 63 mW, -55 to 155 degC, 0402; Power: 63mW; Tolerance: 1%; Max Operating Temperature: 155°C; Pins: 2; Min Operating Temperature: -55°C; Case/Package: 0402
R32 R33 = CMP-2000-00700-2: RES SMD 0 OHM JUMPER 1/10W 0603; Manufacturer: Panasonic; Tolerance: 5%; Description: 0 Ohms Jumper 0.1W, 1/10W Chip Resistor 0603 (1608 Metric) Automotive AEC-Q200 Thick Film; Automotive Grade: Grade 0; Voltage Rating: 75V; Value: 0Ω; Temperature Coefficient: -100/+600ppm/°C; Power Rating: 0.1W; Mouser Description: Resistor, Chip Thick Film, 0 Ohm, 0.1w, Resistor, Chip Thick Film, 0 Ohm, 0.1w, 5%; Manufacturer Part Number: ERJ-3GEY0R00V; Ipc Land Pattern Name: RESC16080X45; Category: Res; Package: 0603; Temperature: -55°C to +155°C; Temperature Range Low: -55°C; Series: ERJ; Resistance: 0Ω; RoHS: TRUE; Composition: Thick Film; Octopart: https://octopart.com/erj-3gey0r00v-panasonic-55389238; Device Class L1: Passive Components; Footprint Url: https://industrial.panasonic.com/cdbs/www-data/pdf/RDA0000/DMA0000COL17.pdf; ComponentLink2Description: Datasheet; Device Class L2: Resistors; Temperature Range High: +155°C; Digikey Description: RES SMD 0 OHM JUMPER 1/10W 0603; Lead Free: Yes; Device Class L3: Chip SMD Resistors; Height: 0.55mm; ComponentLink2URL: https://industrial.panasonic.com/cdbs/www-data/pdf/RDA0000/AOA0000C301.pdf; Automotive: Yes
R34 = CMP-2002-08123-3: as R8 on sheet TOP - NAATOS INLAY; Lead Free: Lead Free; Height: 0.35mm; Contact Plating: Tin; Min Operating Temperature: -55°C; Package Quantity: 10000; Case/Package: 0402; Temperature Coefficient: 100ppm/°C; Number of Terminations: 2; Packaging: Tape and Reel; Max Power Dissipation: 63mW; Case Code (Metric): 1005; Mount: Surface Mount; Width: 0.02inch; Termination: SMD/SMT; Length: 1mm; Number of Pins: 2; Weight: 2.3E-05oz; Radiation Hardening: No; Tolerance: 1%; Military Standard: Not; Features: Automotive AEC-Q200; Depth: 0.5mm; Composition: Thick Film; Max Operating Temperature: 155°C; Voltage Rating: 50V; Case Code (Imperial): 0402
U5 = CMP-019-00051-1: Switching Regulator, 2A, 1500kHz Switching Freq-Max, PDSO5; Max Supply Voltage: 5.5V; Max Operating Temperature: 125°C; Min Operating Temperature: -40°C; RoHS Compliant: Yes; Case/Package: LSSOP; Pins: 5

## Sheet PJ30072S6_3V3_BOOST.SchDoc
size A3; SheetNumber: 7; SheetTotal: 7
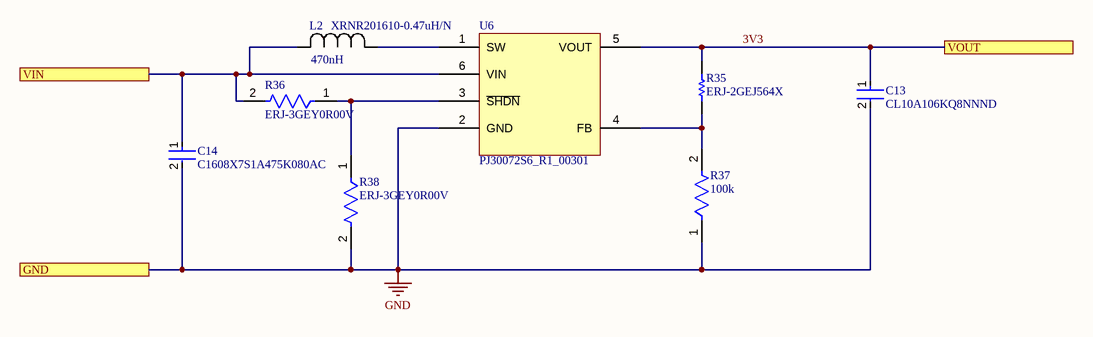
[diagram p5: PJ30072S6_3V3_BOOST.SchDoc]

### Parts
C13  CL10A106KQ8NNND  [FP-CL10-IPC_C]
C14  C1608X7S1A475K080AC  [FP-C1608-080-IPC_B]
L2  XRNR201610-0.47uH/N  Inductance: 470nH  [XRNR201610-0.47uH/N]
R35  ERJ-2GEJ564X  [RESC1005X40X25NL05T05]
R36  ERJ-3GEY0R00V  [FP-ERJ-3GEY0R00V-MFG]
R37  Resistance: 100k  [FP-CRCW0402-e3-IPC_B]  (hidden comment: CRCW0402100KFKED)
R38  ERJ-3GEY0R00V  [FP-ERJ-3GEY0R00V-MFG]
U6  PJ30072S6_R1_00301  [SOT95P280X15-6N]

### Ports
GND, VIN, VOUT

### Nets
3V3: C13.1 R35.2 U6.5(VOUT) ; port VOUT
GND: C13.2 C14.2 R37.1 R38.2 U6.2(GND) ; port GND
V_BATT: C14.1 L2.2 R36.2 U6.6(VIN) ; port VIN
NetL2_1: L2.1 U6.1(SW)
NetR35_1: R35.1 R37.2 U6.4(FB)
NetR36_1: R36.1 R38.1 U6.3(~{SHDN})

### Notes on the sheet
- Sheet Title
- PCB Project Name
- Modified
- Sheet
- of

### Library data of the parts
C13 = CMP-13271-003243-1: Cap Ceramic 10uF 6.3V X5R ±10% Pad SMD 0603 +85°C T/R; Packaging: Tape and Reel; Width: 0.031inch; Radiation Hardening: No; Dielectric: X5R; Height: 0.8mm; Tolerance: 10%; Capacitance: 10uF; Voltage Rating (DC): 6.3V; Min Operating Temperature: -55°C; Depth: 0.8mm; Thickness: 0.035inch; Length: 1.6mm; Voltage Rating: 6.3V; Package Quantity: 10000; Max Operating Temperature: 85°C; Case/Package: 0603; Mount: Surface Mount
C14 = CMP-08246-005491-1: CAP CER 4.7UF 10V X7S 0603; Dielectric Material: Ceramic; Interface: I2C; Frequency: 48MHz; Memory Type: FLASH; Peripherals: Brown-out Detect/Reset; Tolerance: 10%; Oscillator Type: Internal; Number of I/Os: 53; Core Architecture: ARM; Memory Size: 64KB; Voltage Rating: 10V; Lead Free: Lead Free; Case Code (Imperial): 0603; Voltage Rating (DC): 10V; Series: Leopard Gecko; Min Operating Temperature: -40°C; Case/Package: LFBGA; Dielectric: X7S; RoHS Compliant: Yes; Package Quantity: 1000; Capacitance: 4.7uF; Thickness: 800um; Number of Pins: 64; REACH SVHC: No SVHC; Length: 1.6mm; Max Operating Temperature: 125°C; Depth: 0.8mm; Packaging: Tape and Reel; Case Code (Metric): 1608
L2 = XRNR201610-0.47uH/N: 2.35A 2.3A 470nH 59mΩ Magnetic Shielded Inductor ±30% SMD-2P,2x1.6mm Power Inductors ROHS; Manufacturer: Inpaq; Manufacturer Part Number: WIP252012S-1R5MLDG; Supplier: Digikey; Supplier Part Number: 3526-WIP252012S-1R5MLDGCT-ND; RoHS: No; Category: Fixed Inductors
R35 = CMP-2002-00560-1: Manufacturer: Panasonic; Part Number: ERJ-2GEJ564X
R36 R38 = CMP-2000-00700-2: as R32 on sheet TLV62569; Mouser Description: Resistor, Chip Thick Film, 0 Ohm, 0.1w, Resistor, Chip Thick Film, 0 Ohm, 0.1w, 5%; Manufacturer Part Number: ERJ-3GEY0R00V; Ipc Land Pattern Name: RESC16080X45; Category: Res; Package: 0603; Temperature: -55°C to +155°C; Temperature Range Low: -55°C; Series: ERJ; Resistance: 0Ω; RoHS: TRUE; Composition: Thick Film; Octopart: https://octopart.com/erj-3gey0r00v-panasonic-55389238; Device Class L1: Passive Components; Footprint Url: https://industrial.panasonic.com/cdbs/www-data/pdf/RDA0000/DMA0000COL17.pdf; ComponentLink2Description: Datasheet; Device Class L2: Resistors; Temperature Range High: +155°C; Digikey Description: RES SMD 0 OHM JUMPER 1/10W 0603; Lead Free: Yes; Device Class L3: Chip SMD Resistors; Height: 0.55mm; ComponentLink2URL: https://industrial.panasonic.com/cdbs/www-data/pdf/RDA0000/AOA0000C301.pdf; Automotive: Yes
R37 = CMP-2002-08123-3: as R8 on sheet TOP - NAATOS INLAY; Lead Free: Lead Free; Height: 0.35mm; Contact Plating: Tin; Min Operating Temperature: -55°C; Package Quantity: 10000; Case/Package: 0402; Temperature Coefficient: 100ppm/°C; Number of Terminations: 2; Packaging: Tape and Reel; Max Power Dissipation: 63mW; Case Code (Metric): 1005; Mount: Surface Mount; Width: 0.02inch; Termination: SMD/SMT; Length: 1mm; Number of Pins: 2; Weight: 2.3E-05oz; Radiation Hardening: No; Tolerance: 1%; Military Standard: Not; Features: Automotive AEC-Q200; Depth: 0.5mm; Composition: Thick Film; Max Operating Temperature: 155°C; Voltage Rating: 50V; Case Code (Imperial): 0402
U6 = PJ30072S6_R1_00301: IC REG BOOST ADJ SOT23-6; Supplier 1: Mouser; Supplier Part Number 1: 241-PJ30072S6R100301

## Sheet SWD_OVER_USB_C.SchDoc
size A3; SheetNumber: 5; SheetTotal: 7
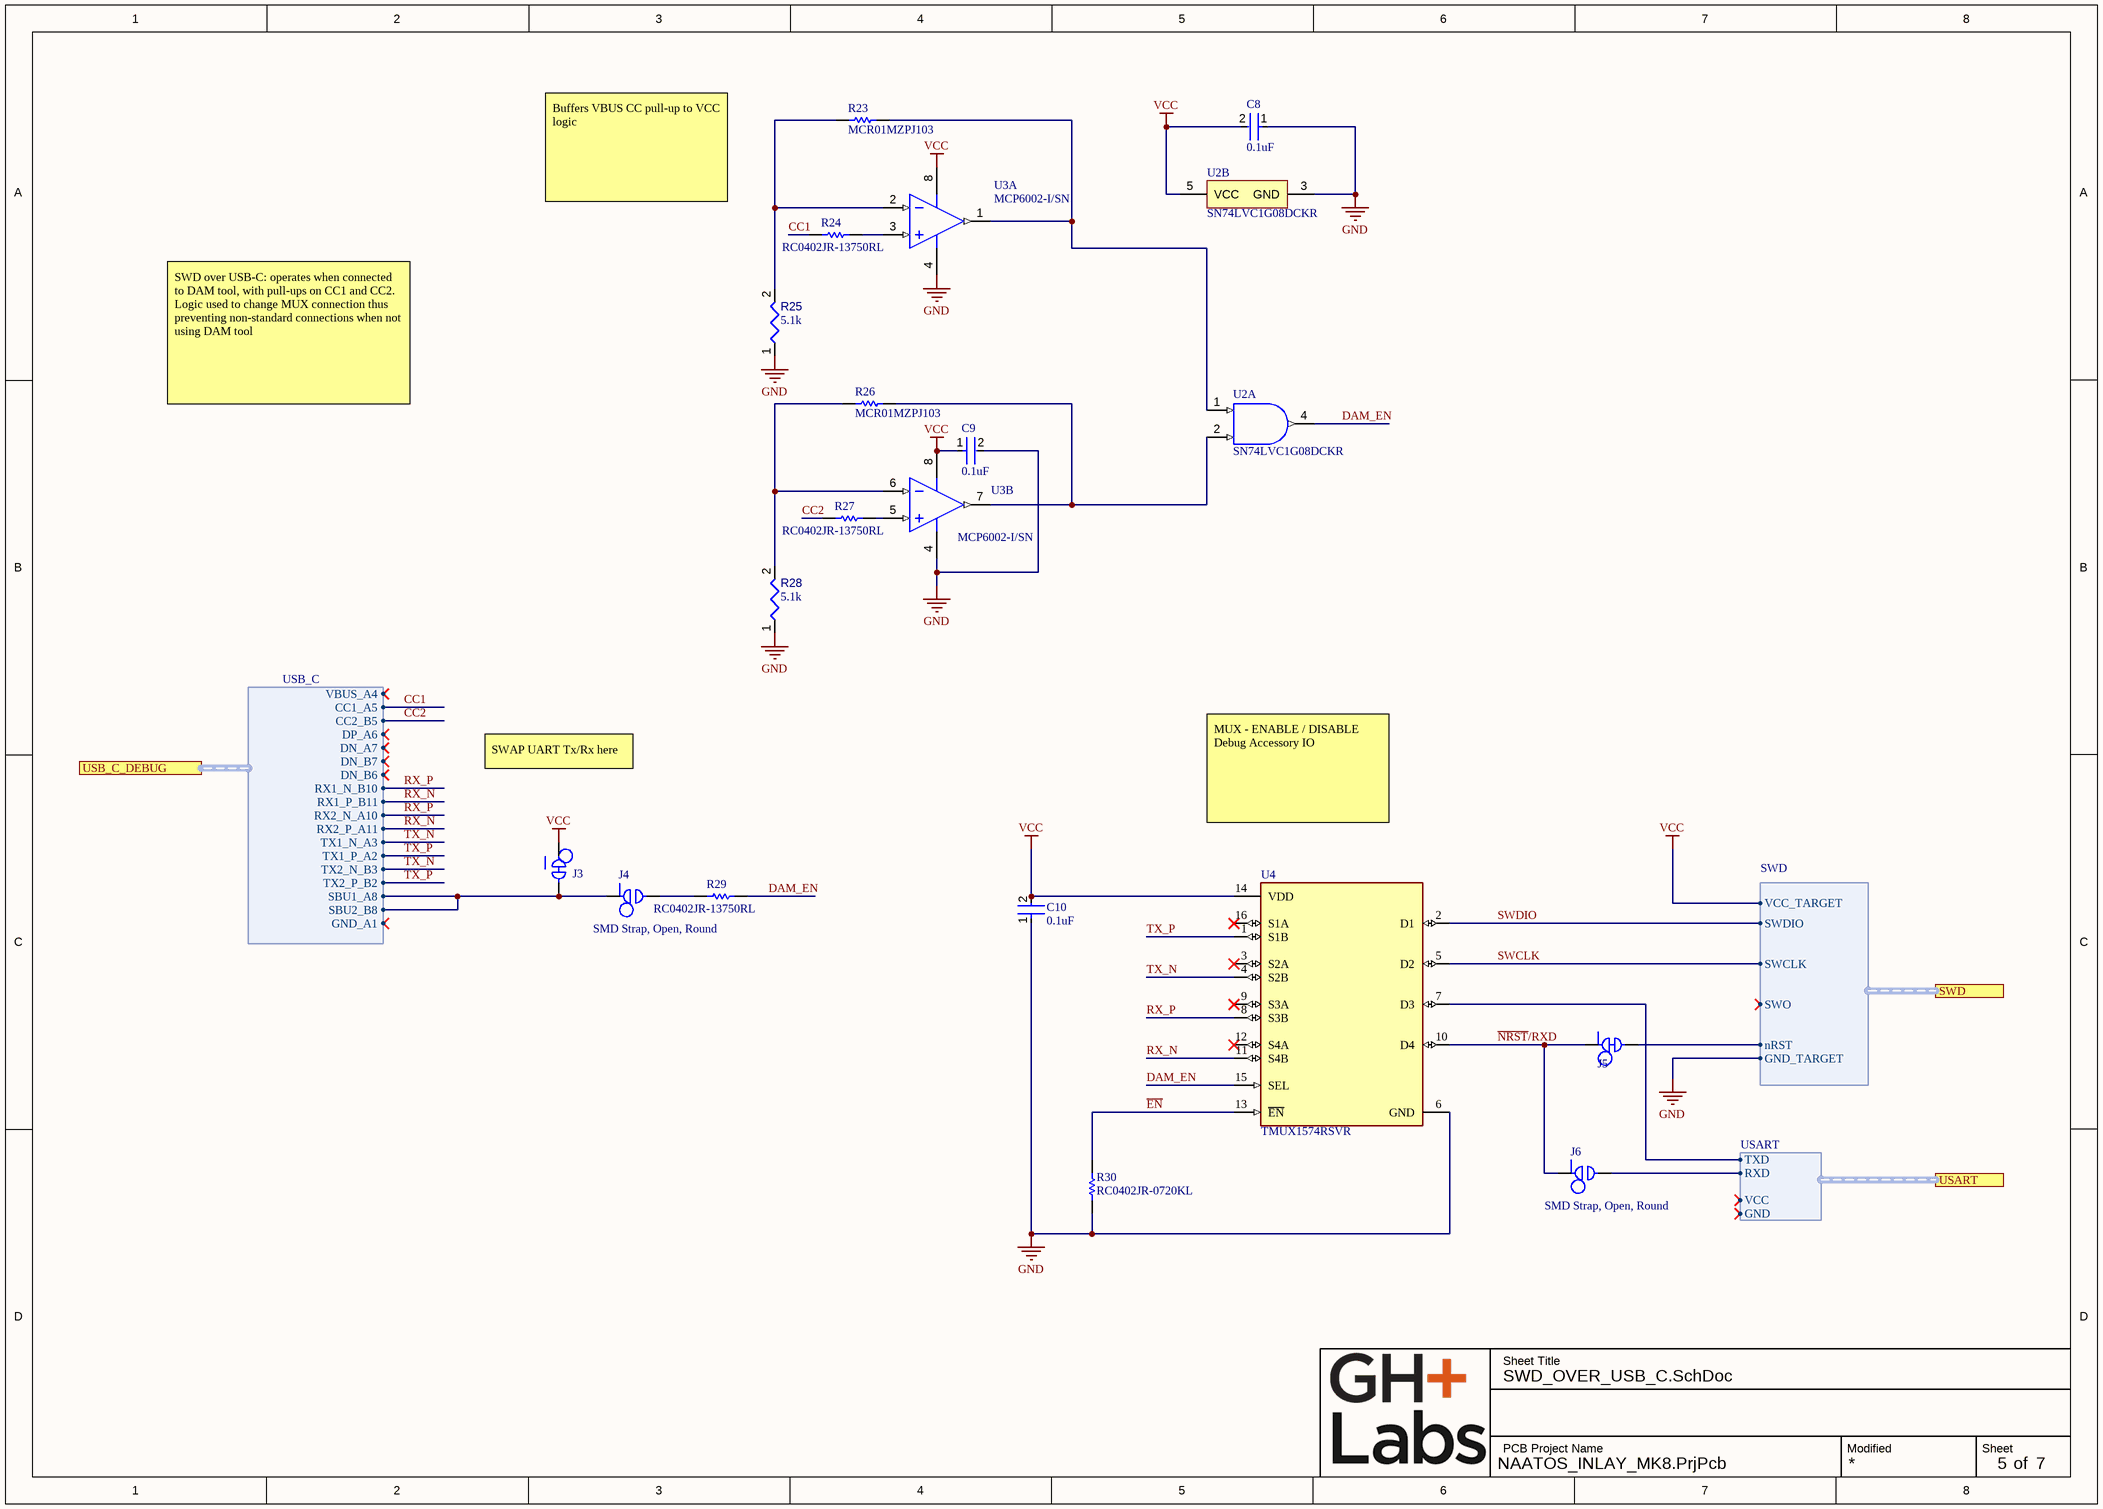
[diagram p6: SWD_OVER_USB_C.SchDoc]

### Parts
C8  0.1uF  [FP-CL17-IPC_C]
C9  0.1uF  [FP-CL17-IPC_C]
C10  0.1uF  [FP-CL17-IPC_C]
J3  SMD Strap, 0603, Closed  [JMP-0603-STRAP-CLOSED]  (value not drawn)  (net tie, no BOM)
J4  SMD Strap, Open, Round  [Open Link, Atmel Design]  (net tie, no BOM)
J5  SMD Strap, 0603, Closed  [JMP-0603-STRAP-CLOSED]  (value not drawn)  (net tie, no BOM)
J6  SMD Strap, Open, Round  [Open Link, Atmel Design]  (net tie, no BOM)
R23  MCR01MZPJ103  [RESC1005X40X23LL05T08]
R24  RC0402JR-13750RL  [RESC1005X40X25LL05T10]
R25  value 5.1k  [RESC0402(1005)_L]  (hidden comment: Resistor 5K1 +/-1 % 0402 63 mW)
R26  MCR01MZPJ103  [RESC1005X40X23LL05T08]
R27  RC0402JR-13750RL  [RESC1005X40X25LL05T10]
R28  value 5.1k  [RESC0402(1005)_L]  (hidden comment: Resistor 5K1 +/-1 % 0402 63 mW)
R29  RC0402JR-13750RL  [RESC1005X40X25LL05T10]
R30  RC0402JR-0720KL  [RESC1005X40X25NL05T10]
U2  SN74LVC1G08DCKR  [DCK0005A_M]  (parts A,B of 2)
U3  MCP6002-I/SN  [SOIC-SN8_M]  (parts A,B of 2)
U4  TMUX1574RSVR  [FP-RSV0016A-MFG]

### Ports
SWD (harness SWD), USART (harness USART), USB_C_DEBUG (harness USB_C)

### Harnesses
USB_C: VBUS_A4, CC1_A5, CC2_B5, DN_A7, DP_A6, DN_B7, DN_B6, RX1_N_B10, RX1_P_B11, RX2_N_A10, RX2_P_A11, TX1_N_A3, TX1_P_A2, TX2_N_B3, TX2_P_B2, SBU1_A8, SBU2_B8, GND_A1
SWD: GND_TARGET, nRST, SWCLK, SWDIO, SWO, VCC_TARGET
USART: GND, RXD, TXD, VCC

### Nets
GND: C8.1 C9.2 C10.1 R25.1 R28.1 R30.1 U2.3(GND) U3.4(VSS) U4.6(GND) ; port USB_C_DEBUG.GND_A1, port SWD.GND_TARGET, port USART.GND
VCC: C8.2 C9.1 C10.2 J3.1 U2.5(VCC) U3.8(VDD) U4.14(VDD) ; port SWD.VCC_TARGET, port USART.VCC  [project net VCC_MCU]
CC1: R24.1 ; port USB_C_DEBUG.CC1_A5
CC2: R27.1 ; port USB_C_DEBUG.CC2_B5
DAM_EN: R29.2 U2.4(Y) U4.15(SEL)
~{EN}: R30.2 U4.13(~{EN})
~{NRST}/RXD: J5.1 J6.1 U4.10(D4)
PY32_NRST: J5.2 ; port SWD.nRST
RX_N: U4.11(S4B) ; port USB_C_DEBUG.RX1_P_B11, port USB_C_DEBUG.RX2_P_A11  [project net A11_B11]
RX_P: U4.8(S3B) ; port USB_C_DEBUG.RX1_N_B10, port USB_C_DEBUG.RX2_N_A10  [project net A10_B10]
RXD: J6.2 ; port USART.RXD
SBU_S: J3.2 J4.1 ; port USB_C_DEBUG.SBU1_A8, port USB_C_DEBUG.SBU2_B8
SWCLK: U4.5(D2) ; port SWD.SWCLK  [project net PY32_SWCLK]
SWDIO: U4.2(D1) ; port SWD.SWDIO  [project net PY32_SWDIO]
TX_N: U4.4(S2B) ; port USB_C_DEBUG.TX1_N_A3, port USB_C_DEBUG.TX2_N_B3  [project net PY32_SWCLK_S]
TX_P: U4.1(S1B) ; port USB_C_DEBUG.TX1_P_A2, port USB_C_DEBUG.TX2_P_B2  [project net PY32_SWDIO_S]
TXD: U4.7(D3) ; port USART.TXD
NetJ4_2: J4.2 R29.1
NetR23_1: R23.1 R25.2 U3.2(VINA-)
NetR23_2: R23.2 U2.1(A) U3.1(VOUTA)
NetR24_2: R24.2 U3.3(VINA+)
NetR26_1: R26.1 R28.2 U3.6(VINB-)
NetR26_2: R26.2 U2.2(B) U3.7(VOUTB)
NetR27_2: R27.2 U3.5(VINB+)

Not connected (* = marked no-connect by the designer): U4 3(S2A)* 9(S3A)* 12(S4A)* 16(S1A)*

### Notes on the sheet
- Buffers VBUS CC pull-up to VCC logic
- SWD over USB-C: operates when connected to DAM tool, with pull-ups on CC1 and CC2. Logic used to change MUX connection thus preventing non-standard connections when not using DAM tool
- SWAP UART Tx/Rx here
- MUX - ENABLE / DISABLE Debug Accessory IO
- Sheet Title
- PCB Project Name
- Modified
- Sheet
- of

### Library data of the parts
C8-C10 = CMP-13271-001069-1: as C1 on sheet TOP - NAATOS INLAY; Height: 0.5mm; Case/Package: 0402; Contact Plating: Tin; Case Code (Imperial): 0402; Capacitance: 100nF; Thickness: 0.022inch; Min Operating Temperature: -55°C; Package Quantity: 1; Length: 1mm; Max Operating Temperature: 125°C; Depth: 0.5mm; Voltage Rating: 10V; Packaging: Tape and Reel; Mount: Surface Mount; Tolerance: 10%; Width: 0.02inch; Radiation Hardening: No; Case Code (Metric): 1005; Dielectric: X7R
J3 J5 = CMP-001-0027-01.A.1
J4 J6 = CMP-001-0038-01.A.1
R23 R26 = CMP-2000-06684-1: Chip Resistor, 10 KOhm, +/- 5%, 63 mW, -55 to 155 degC, 0402 (1005 Metric), RoHS, Tape and Reel; Manufacturer: Rohm; Temp Coefficient: ±200ppm/°C; Resistance: 10kO; Rated Power: 0.063W; Datasheet URL: http://www.rohm.com/web/global/datasheet/MCR01MZPJ; Package Description: 2-Pin Surface Mount Device, Body 1 x 0.5 mm; Tolerance (%): ±5%; Manufacturer URL: http://www.rohm.com/web/global/; Size Code: 1005; Package Reference: 0402; Datasheet Version: Rev. J, 06/2016; Mounting Technology: SurfaceMount
R24 R27 R29 = CMP-2002-08095-1: Manufacturer: Yageo; Part Number: RC0402JR-13750RL
R25 R28 = CMP-009-00177-1: as R20 on sheet CONNECTORS; Case/Package: 0402; Pins: 2; RoHS Compliant: Yes; Max Operating Temperature: 155°C; Min Operating Temperature: -55°C; Mounting Technology: Surface Mount
R30 = CMP-2002-07956-1: Manufacturer: Yageo / Phycomp; Part Number: RC0402JR-0720KL
U2 = CMP-0859-00266-3: Single 2-Input Positive-AND Gate, DCK0005A, LARGE T&R; Manufacturer: Texas Instruments; tpd @ Nom Voltage(Max)(ns): 4.5,6,4,5; F @ Nom Voltage(Max)(Mhz): 150; ICC @ Nom Voltage(Max)(mA): 0.01; Bits(#): 1; VCC(Min)(V): 1.65; Gate Type: AND; Rating: Catalog; Output Type: CMOS; Voltage(Nom)(V): 1.8,2.5,3.3,5; Technology Family: LVC; VCC(Max)(V): 5.5; Input Type: CMOS/TTL; Schmitt Trigger: No; Output Drive (IOL/IOH)(Max)(mA): 32/-32; Logic: True; Generic Part Number: SN74LVC1G08; DatasheetVersion: SCES217Y; Sub-Family: AND Gate; 3-State Output: No; Operating Temperature Range(C): -40 to 125,-40 to 85; PackageReference: DCK0005A
U3 = CMP-0187-00365-3: None; Bandwidth: 1MHz; Number of Elements: 2; Power Supply Rejection Ratio (PSRR): 86dB; Nominal Supply Current: 100uA; Max Supply Voltage: 6V; Input Offset Voltage-Max: 4.5mV; Voltage Gain: 112dB; Input Bias Current: 1pA; Min Supply Voltage: 1.8V; Slew Rate: 0.6V/µs; Operating Supply Voltage: 5.5V; Amplifier Type: GENERAL PURPOSE; Output Current: 23mA; Common Mode Rejection Ratio: 60dB; Gain Bandwidth Product: 1MHz; Min Operating Temperature: -40°C; Supply Current: 100uA; Number of Circuits: 2; Package Quantity: 100; Width: 3.9mm; Technology: CMOS; RoHS Compliant: Yes; Radiation Hardening: No; Mount: Surface Mount; Number of Pins: 8; Length: 4.9mm; Case/Package: SOIC; Number of Channels: 2; Max Operating Temperature: 85°C; Unity Gain Bandwidth Product: 1MHz; Lead Free: Lead Free; Number of Amplifiers: 2; REACH SVHC: No SVHC; Slew Rate-Nom: 0.6V/µs; Height: 1.25mm; Input Offset Voltage (Vos): 4.5mV; Packaging: Rail/Tube
U4 = CMP-04892-000064-2: IC SWITCH SPDT QUAD 16UQFN; RoHS Compliant: Yes

## Nets that join several sheets
2V5: TOP - NAATOS INLAY (R2.1 R5.2), TLV62569 (C11.1 L1.2 R31.1)
3V3: TOP - NAATOS INLAY (R3.1), PJ30072S6_3V3_BOOST (C13.1 R35.2 U6.5)
GND: TOP - NAATOS INLAY (C1.1 R9.2), HEATER and DRIVER (8 pins), CONNECTORS (13 pins), MCU (11 pins), TLV62569 (5 pins), PJ30072S6_3V3_BOOST (5 pins), SWD_OVER_USB_C (9 pins)
V_BATT: TOP - NAATOS INLAY (R1.1 R4.2 R8.1), CONNECTORS (BT1.P_1 R19.2), TLV62569 (C12.1 R32.2 U5.4), PJ30072S6_3V3_BOOST (C14.1 L2.2 R36.2 U6.6)
VCC_MCU: TOP - NAATOS INLAY (5 pins), CONNECTORS (J2.1), MCU (5 pins), SWD_OVER_USB_C (7 pins)
A10_B10: CONNECTORS (J1.A10 J1.B10), SWD_OVER_USB_C (U4.8)
A11_B11: CONNECTORS (J1.A11 J1.B11), SWD_OVER_USB_C (U4.11)
AMP_CTRL1: HEATER and DRIVER (Q1.1 R10.1), MCU (U1.13)
AMP_CTRL2: HEATER and DRIVER (Q2.1 R11.2), MCU (U1.14)
CC1: CONNECTORS (J1.A5 R20.2), MCU (U1.6), SWD_OVER_USB_C (R24.1)
CC2: CONNECTORS (J1.B5 R21.2), MCU (U1.3), SWD_OVER_USB_C (R27.1)
HEATER+: TOP - NAATOS INLAY (R4.1 R5.1), HEATER and DRIVER (H1.1 H1.4)
LED1_N: TOP - NAATOS INLAY (R6.1), MCU (U1.4)
LED2_N: TOP - NAATOS INLAY (R7.1), MCU (U1.12)
PY32_NRST: CONNECTORS (J2.3), MCU (R16.1 U1.18), SWD_OVER_USB_C (J5.2)
PY32_SWCLK: CONNECTORS (J2.4), MCU (U1.11), SWD_OVER_USB_C (U4.5)
PY32_SWCLK_S: CONNECTORS (J1.A3 J1.B3), SWD_OVER_USB_C (U4.4)
PY32_SWDIO: CONNECTORS (J2.2), MCU (U1.10), SWD_OVER_USB_C (U4.2)
PY32_SWDIO_S: CONNECTORS (J1.A2 J1.B2), SWD_OVER_USB_C (U4.1)
RXD: CONNECTORS (R22.1), MCU (U1.20), SWD_OVER_USB_C (J6.2)
SBU_S: CONNECTORS (J1.A8 J1.B8), SWD_OVER_USB_C (J3.2 J4.1)
TXD: CONNECTORS (J2.6), MCU (U1.19), SWD_OVER_USB_C (U4.7)
V_BATT_SENSE: TOP - NAATOS INLAY (C1.2 R8.2 R9.1), MCU (U1.5)
VALVE_CTRL1: HEATER and DRIVER (Q3.1 R12.2), MCU (U1.16)
VALVE_CTRL2: HEATER and DRIVER (Q4.1 R13.2), MCU (U1.17)

## Assembly variants
MK8AA_BATTERIES: not fitted C11 C12 J2 L1 R1 R2 R5 R14 R19 R22 R31 R32 R33 R34 R38 U5
MK8AA_BATTERIES_ECO: not fitted C8 C9 C10 C11 C12 J1 J2 J3 J4 L1 R1 R2 R5 R14 R19 R20 R21 R22 R23 R24 R25 R26 R27 R28 R29 R30 R31 R32 R33 R34 R38 U2 U3 U4 U5
MK8_USBC_DEBUG: not fitted J2 R1 R3 R4 R14 R22 R33 R38
MK8_USBC_ECO: not fitted BT1 BT2 C8 C9 C10 C13 C14 J2 J3 J4 L2 R1 R3 R4 R14 R22 R23 R24 R25 R26 R27 R28 R29 R30 R33 R35 R36 R37 R38 U2 U3 U4 U6